# EAGLE board EEZ CF-DIC r3B2 (EAGLE 6.1)
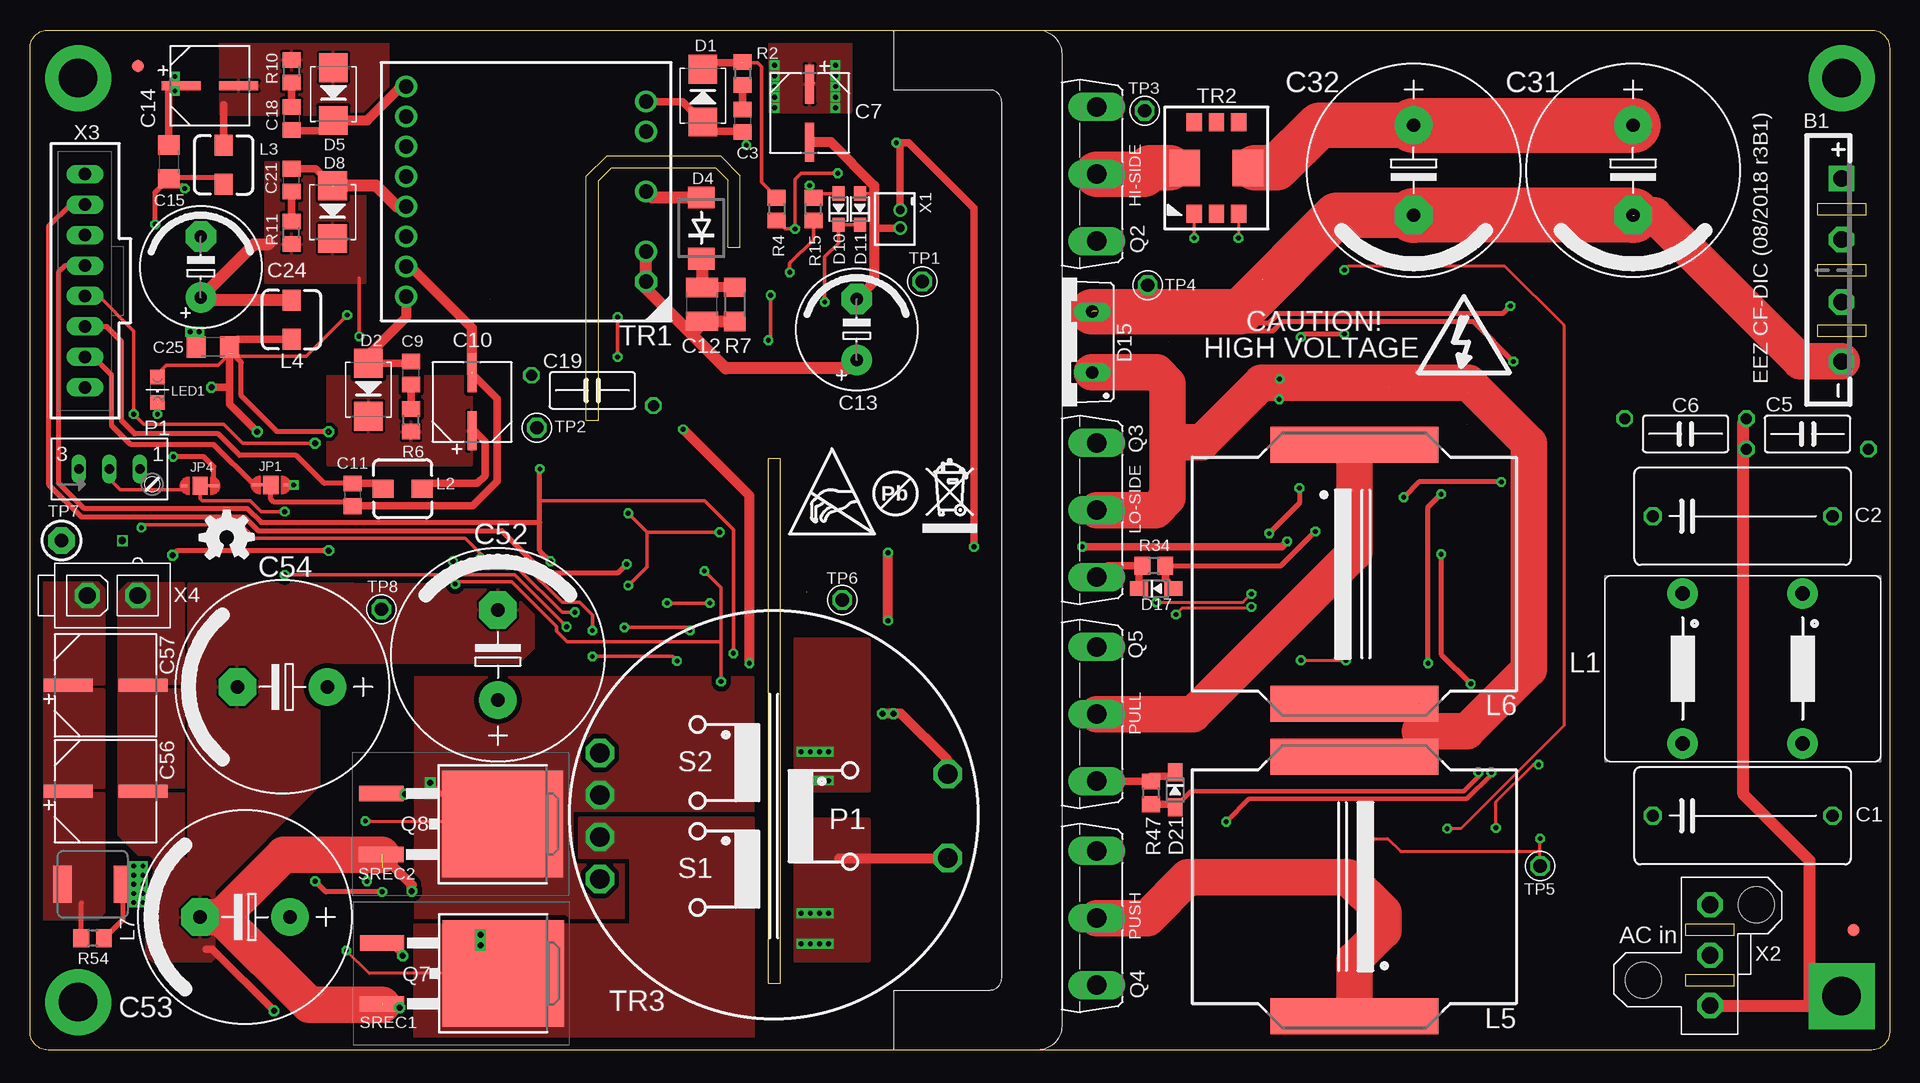
[diagram p3: board, top side]
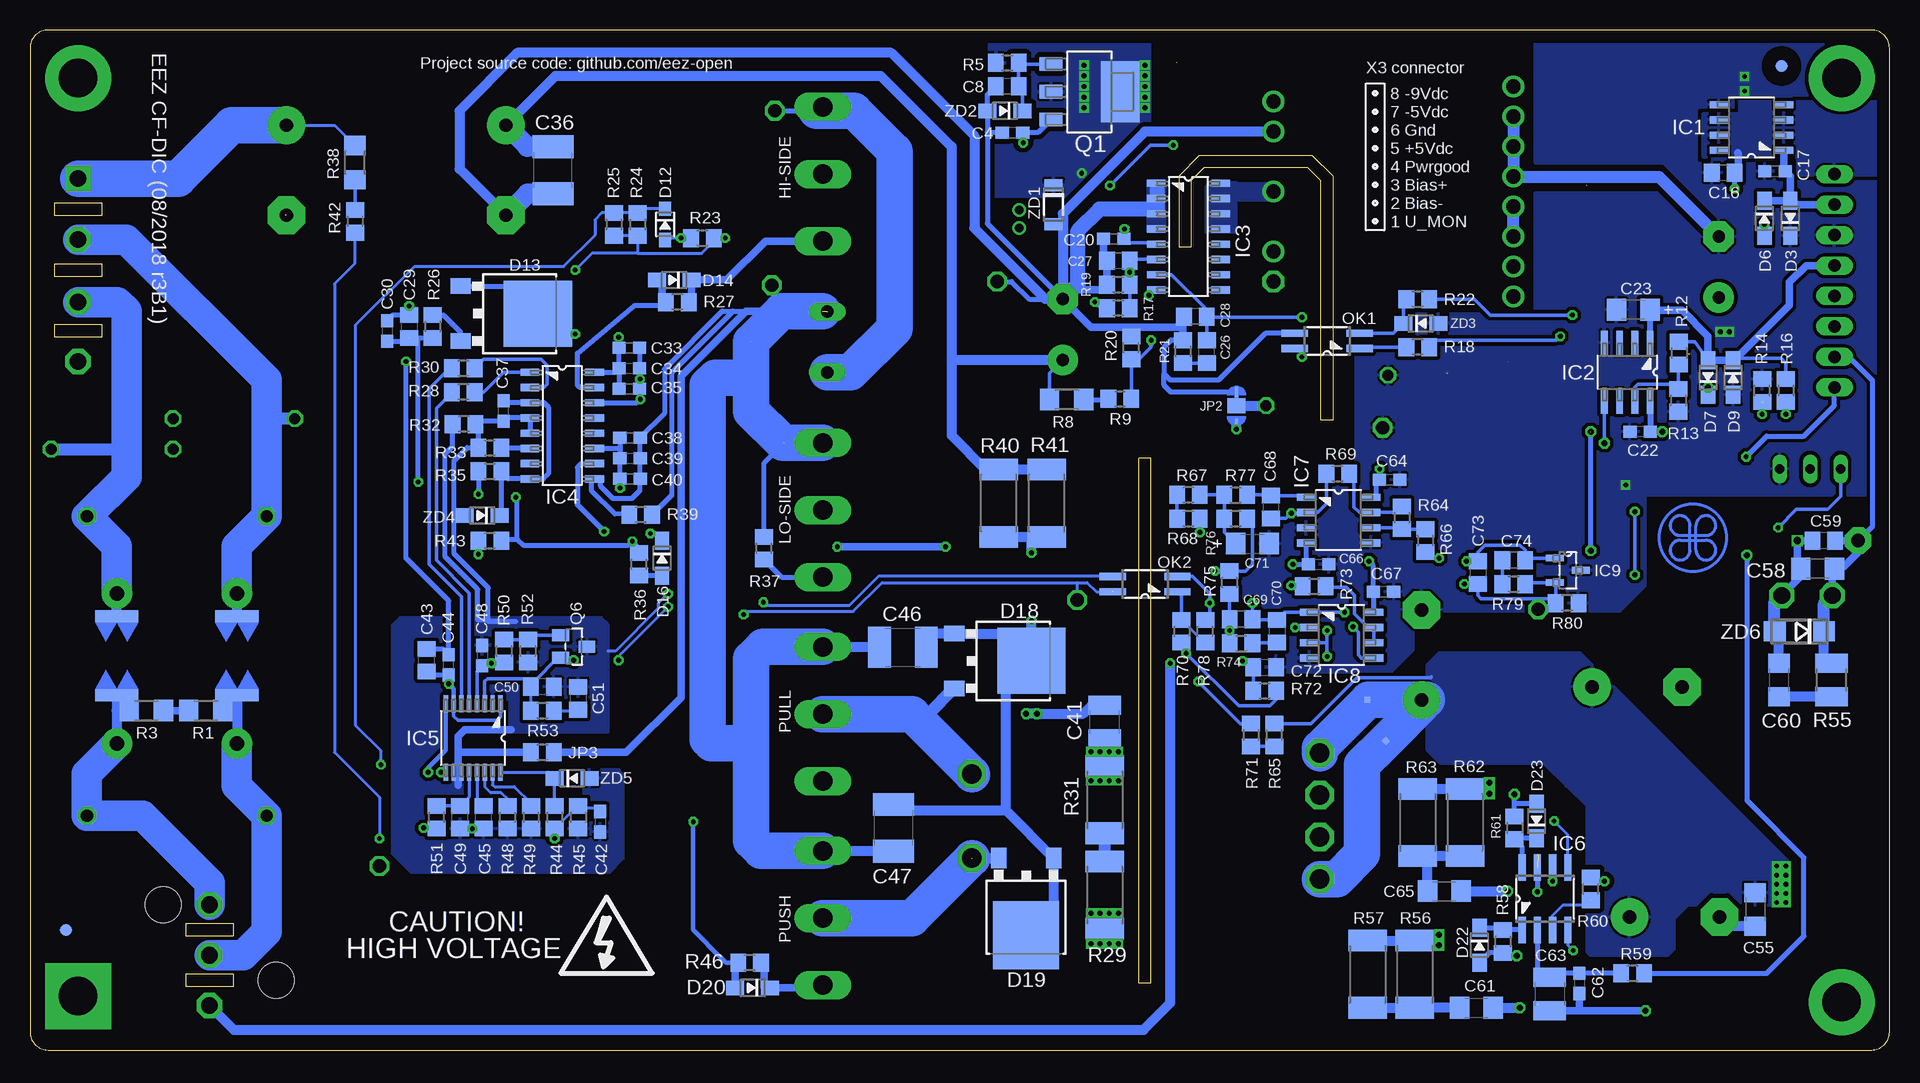
[diagram p4: board, bottom side, seen from below]

Size 155 x 85 mm. Coordinates in mm from the lower left corner, seen from the top.
Outline: 155,83.5 155,1.5 arc-90 153.5,0 1.5,0 arc-90 0,1.5 0,83.5 arc-90 1.5,85 153.5,85 arc-90 155,83.5
Outline: 59.2,66.9 59.2,72.87 57.55,74.52 48.09,74.52 46.37,72.8 46.37,52.48 47.39,52.48 47.39,72.42 48.47,73.5 57.17,73.5 58.18,72.49 58.18,66.9 59.2,66.9
Outline: 62.56,5.56 62.56,49.31 61.55,49.31 61.55,5.56 62.56,5.56
Copper layers (1*16): Top 0.035mm / dielectric 1.5mm / Bottom 0.035mm
Design rules: minimum track width 6mil, minimum drill 0.3mm, track to track 6mil, track to pad 6mil, pad to pad 6mil, via to via 6mil, smd to smd 6mil, copper to edge 40mil, drill to drill 8mil, minimum pad ring 4mil, minimum via ring 8mil, stop-mask expansion 2.5mil, vias tented up to drill 0.55mm, thermal gap 8mil
Net classes: 0 default: width 0.203 mm, drill 0.3 mm, clearance 0.203 mm; 1 lvds: width 0.152 mm, drill 0.3 mm, clearance 0.152 mm to class 0, clearance 0.152 mm; 2 gnd: width 0.254 mm, drill 0.584 mm, clearance 0.254 mm
tRestrict: area 81,0 to 86,85; area 69,0 to 81,5; area 69,80 to 81,85

## Footprints (pad centres in the part's own frame; a part is rotated, then mirrored left to right if it is on the bottom)
GBU4K_CRE = drill 1.4 square: + -7.62,0 | drill 1.4 octagon: - 7.62,0; AC1 -2.54,0; AC2 2.667,0
C150-084X183 = drill 1.016 octagon: 1 -7.493,0; 2 7.493,0
C0805 = smd 1.3 x 1.5: 1 -0.95,0; 2 0.95,0
C0603 = smd 1.1 x 1: 1 -0.85,0; 2 0.85,0
CY075-032X103 = drill 0.914 octagon: 1 -5.08,1.27; 2 5.08,-1.27
CAPAE660X610N = smd 3.251 x 0.762: 1 -2.413,0; 2 2.413,0
C1210 = smd 1.6 x 2.7: 1 -1.4,0; 2 1.4,0
ECAP5/10.5 = drill 1.016 pad 2.54: + -2.54,0 | drill 1.016 pad 2.54 octagon: - 2.54,0
C1206 = smd 1.6 x 1.8: 1 -1.4,0; 2 1.4,0
EC1206 = smd 1.6 x 1.8: + -1.4,0; - 1.4,0
ECAP7.5/18 = drill 1.1 pad 3.14: + -3.75,0 | drill 1.1 pad 3.14 octagon: - 3.75,0
C1812 = smd 1.9 x 3.4: 1 -1.95,0; 2 1.95,0
CAPAE830X1050N = smd 4.064 x 1.092: 1 -3.124,0; 2 3.124,0
SMB = smd 2.4 x 2.4: A 2.2,0; C -2.2,0
SOD323-W = smd 1.5 x 1.2: A 1.45,0; C -1.45,0
DO214AA = smd 1.8 x 2.2: A 2.55,0; C -2.55,0
SOD323-R = smd 1.2 x 1: A 1.3,0; C -1.3,0
TO252 = smd 1.3 x 1.7: 1 -2.285,-5.49; 2 2.285,-5.49 | smd 5.5 x 5.7: 3 0,0.95
TO220-2 = drill 1.016 long: 1 -2.54,-2.54; 2 2.54,-2.54
FIDUCIAL_DUAL = smd 1.016 x 1.016 bottom: B 0,0 | smd 1.016 x 1.016: T 0,0
SOIC127P600X173-8N = smd 1.55 x 0.6: 1 -2.7,1.9; 2 -2.7,0.63; 3 -2.7,-0.64; 4 -2.7,-1.91; 5 2.7,-1.91; 6 2.7,-0.64; 7 2.7,0.63; 8 2.7,1.9
SOIC127P600X175-8N = smd 1.981 x 0.559: 1 -2.464,1.905; 2 -2.464,0.635; 3 -2.464,-0.635; 4 -2.464,-1.905; 5 2.464,-1.905; 6 2.464,-0.635; 7 2.464,0.635; 8 2.464,1.905
SOIC-16 = smd 1.549 x 0.61: 1 -2.692,4.445; 2 -2.692,3.175; 3 -2.692,1.905; 4 -2.692,0.635; 5 -2.692,-0.635; 6 -2.692,-1.905; 7 -2.692,-3.175; 8 -2.692,-4.445; 9 2.692,-4.445; 10 2.692,-3.175; 11 2.692,-1.905; 12 2.692,-0.635; 13 2.692,0.635; 14 2.692,1.905; 15 2.692,3.175; 16 2.692,4.445
MTC16 = smd 1.422 x 0.356: 1 -2.845,2.275; 2 -2.845,1.625; 3 -2.845,0.975; 4 -2.845,0.325; 5 -2.845,-0.325; 6 -2.845,-0.975; 7 -2.845,-1.625; 8 -2.845,-2.275; 9 2.845,-2.275; 10 2.845,-1.625; 11 2.845,-0.975; 12 2.845,-0.325; 13 2.845,0.325; 14 2.845,0.975; 15 2.845,1.625; 16 2.845,2.275
SO8 = smd 0.6 x 2.2: 1 -1.905,-2.6; 2 -0.635,-2.6; 3 0.635,-2.6; 4 1.905,-2.6; 5 1.905,2.6; 6 0.635,2.6; 7 -0.635,2.6; 8 -1.905,2.6
SOT103P240X110-3N = smd 1.524 x 0.559: 1 -1.079,1.016; 2 -1.079,-1.016; 3 1.079,0
JP3-CUT = smd 1.27 x 1.524: COM 0,0 | smd 0.889 x 0.254: NC -1.143,0 | smd 0.508 x 0.254: NO 1.333,0
R0805 = smd 1.3 x 1.5: 1 -0.95,0; 2 0.95,0
RN214 = drill 1.2 pad 2.54: 1 -6.25,-5; 2 6.25,-5; 3 -6.25,5; 4 6.25,5
DE0403 = smd 1.5 x 1.75: 1 0,1.626; 2 0,-1.625
MURATA_6000B = smd 3 x 14: 1 -10.8,0; 2 10.8,0
IHLP-2020BZ-11 = smd 3.048 x 1.524: 1 0,2.515; 2 0,-2.515
LED_0805 = smd 1.2 x 1.2: A 0,-1.05; C 0,1.05
SO4 = smd 0.6 x 2.2: 1 -0.635,-2.7; 2 0.635,-2.7; 3 0.635,2.7; 4 -0.635,2.7
S64W = drill 0.813 long: A 2.54,1.27; E -2.54,1.27; S 0,1.27
SOT230P700X180-4N = smd 1.905 x 1.143: 1 -3.2,2.311; 2 -3.2,0; 3 -3.2,-2.311 | smd 3.175 x 5.08: 4 2.565,0
TO247BV = drill 1.6 long: D 0,-2.921; G -5.588,-2.921; S 5.588,-2.921
SOT23-BEC = smd 1 x 1.4: B -0.95,-1.1; C 0,1.1; E 0.95,-1.1
TO263 = smd 1.3 x 3.7: 1 -2.54,-7.87; 2 2.54,-7.87 | smd 8.9 x 10.1: 3 0,2.23
R1206 = smd 1.6 x 1.803: 1 -1.422,0; 2 1.422,0
R2512 = smd 1.8 x 3.2: 1 -2.8,0; 2 2.8,0
R1210 = smd 1.6 x 2.7: 1 -1.4,0; 2 1.4,0
PCB-SAR_2.4MM = smd 3.6 x 1: 1 0,-3.3; 2 0,3.3
SHORT_NOHOLE = smd 0.5 x 0.25 bottom: P$1 0,0.117; P$2 0,-0.117
PCB_SHIELD_TAB = drill 1.1 octagon: 1 0,0
TP_1.1MM_2 = drill 0.6 square: GND 5.08,0 | drill 1.1 pad 2.184 octagon: TIP 0,0
FERYSTER_5572 = drill 1.2 octagon: 1 -10,7.5 | drill 1.2: 2 -10,5; 4 -10,0; 6 -10,-5; 7 -10,-7.5; 8 10,-8.75; 9 10,-6.25; 10 10,-3.75; 11 10,-1.25; 12 10,1.25; 13 10,3.75; 14 10,6.25; 15 10,8.75
MURATA_5300 = smd 1.27 x 1.524: 1 -1.854,-3.81; 2 0,-3.81; 3 1.854,-3.81; 4 1.854,3.81; 5 0,3.81; 6 -1.854,3.81 | smd 2.54 x 3.048: 7 2.616,0; 8 -2.616,0
VAC_DUAL_SEC = drill 1.6 octagon: P1 -14.5,3.5; P1_DOT -14.5,-3.5; S1 14.5,5.25; S1_DOT 14.5,1.75; S2 14.5,-1.75; S2_DOT 14.5,-5.25
B2B-ZR = drill 0.7 pad 1.1: 1 -0.75,0; 2 0.75,0
MINIFIT_39301039_CRE = drill 1.4 octagon: 1 0,4.2; 2 0,0; 3 0,-4.2 | hole 3: 5.55,2.1; -3.85,-4.2
70543-08 = drill 1.016 long: 1 -8.89,0; 2 -6.35,0; 3 -3.81,0; 4 -1.27,0; 5 1.27,0; 6 3.81,0; 7 6.35,0; 8 8.89,0
MINIFIT_5566-02A = drill 1.4 octagon: 1 0,2.1; 2 0,-2.1
SOD123FL = smd 1 x 1.5: A 1.625,0; C -1.625,0
DO214AC = smd 1.8 x 1.7: A 2.05,0; C -2.05,0

## Placement (x,y rotation side)
B1  GBU4K  [GBU4K_CRE]  151,65 270 top
C1  MKP-X2-220NR15/310  [C150-084X183]  142.76,19.53 0 top
C2  MKP-X2-220NR15/310  [C150-084X183]  142.76,44.48 0 top
C3  3n3  [C0805]  59.39,77.44 270 top
C4  N.C.  [C0603]  73.11,76.42 180 bottom
C5  CY1Y-470P  [CY075-032X103]  148.16,51.34 0 top
C6  CY1Y-470P  [CY075-032X103]  138,51.34 180 top
C7  EEEFK1V470P  [CAPAE660X610N]  64.98,78.07 270 top
C8  470n  [C0805]  73.55,80.3 180 bottom
C9  3n3  [C0805]  31.77,56.42 90 top
C10  EEEFK1V470P  [CAPAE660X610N]  36.85,54.01 90 top
C11  1u  [C0805]  26.88,46.26 270 top
C12  1n/1kV  [C1210]  56.02,62.14 90 top
C13  UCY2G6R8MPD  [ECAP5/10.5]  68.91,60.04 90 top
C14  EEEFK1V470P  [CAPAE660X610N]  15,80.36 0 top
C15  4u7  [C1206]  11.57,74.01 270 top
C16  470n  [C0805]  13.86,73.12 0 bottom
C17  100n  [C0603]  9.54,73.25 0 bottom
C18  3n3  [C0805]  21.8,77.63 270 top
C19  CY1Y-470P  [CY075-032X103]  46.88,54.96 180 top
C20  100n  [C0603]  64.66,67.6 0 bottom
C21  3n3  [C0805]  21.8,72.49 90 top
C22  100n  [C0603]  20.78,51.53 180 bottom
C23  4u7  [EC1206]  21.35,61.69 180 bottom
C24  470u  [ECAP5/10.5]  14.24,65.25 90 top
C25  4u7  [C1206]  15.26,58.58 180 top
C26  33n  [C0805]  56.91,58.2 90 bottom
C27  100p  [C0805]  64.28,65.75 180 bottom
C28  2n2  [C0805]  57.87,61.12 180 bottom
C29  1u  [C0805]  123.4,60.29 270 bottom
C30  100n  [C0603]  125.24,59.91 270 bottom
C31  UCY2G121MHD  [ECAP7.5/18]  133.62,73.31 270 top
C32  UCY2G121MHD  [ECAP7.5/18]  115.33,73.31 270 top
C33  10n  [C0603]  105.05,58.52 0 bottom
C34  100n  [C0603]  105.05,56.8 0 bottom
C35  100n  [C0603]  105.05,55.09 0 bottom
C36  100n/500V  [C1812]  111.4,73.31 90 bottom
C37  100n  [C0603]  115.52,53.24 90 bottom
C38  10n  [C0603]  104.98,51.02 0 bottom
C39  100n  [C0603]  104.98,49.31 0 bottom
C40  100n  [C0603]  104.98,47.59 0 bottom
C41  2n2/1kV  [C1210]  65.42,27.34 90 bottom
C42  10n  [C0603]  107.46,19.02 270 bottom
C43  1u  [C0805]  121.94,32.48 90 bottom
C44  100n  [C0603]  120.09,32.1 90 bottom
C45  1u  [C0805]  117.17,19.4 90 bottom
C46  100n/500V  [C1812]  82.25,33.56 0 bottom
C47  100n/500V  [C1812]  83.01,18.51 90 bottom
C48  100n  [C0603]  117.3,32.86 270 bottom
C49  220p  [C0805]  119.14,19.4 90 bottom
C50  470p  [C0805]  112.28,30.26 180 bottom
C51  N.C.  [C0805]  109.3,29.31 270 bottom
C52  UPW1J152MHD  [ECAP7.5/18]  39.01,32.92 90 top
C53  UPW1J152MHD  [ECAP7.5/18]  17.92,11.08 180 top
C54  UPW1J152MHD  [ECAP7.5/18]  21.04,30.26 180 top
C55  1u/100V  [C1206]  11.19,11.72 270 bottom
C56  HHXC630ARA330MHA0G  [CAPAE830X1050N]  6.3,21.56 0 top
C57  HHXC630ARA330MHA0G  [CAPAE830X1050N]  6.3,30.38 0 top
C58  1u/100V  [C1206]  5.99,40.1 180 bottom
C59  100n/100V  [C0805]  5.48,42.45 180 bottom
C60  N.C.  [C1206]  9.22,30.83 270 bottom
C61  4n7/200V  [C1206]  34.43,3.52 0 bottom
C62  100n  [C0603]  25.86,5.56 270 bottom
C63  10u  [C1210]  28.34,4.67 270 bottom
C64  100n  [C0603]  41.67,47.53 0 bottom
C65  4n7/200V  [C1206]  37.1,13.24 0 bottom
C66  100n  [C0603]  47.58,40.48 0 bottom
C67  100n  [C0603]  42.18,38.2 0 bottom
C68  100p  [C0805]  51.58,45.24 270 bottom
C69  100p  [C0805]  54.05,35.91 180 bottom
C70  33n  [C0805]  51.07,34.89 270 bottom
C71  4u7  [EC1206]  53.1,42.2 0 bottom
C72  1u  [C0805]  52.09,31.91 0 bottom
C73  N.C.  [C0805]  34.31,39.78 270 bottom
C74  N.C.  [C0805]  31.32,40.8 180 bottom
D1  SS110B  [SMB]  56.09,79.53 270 top
D2  SS110B  [SMB]  28.21,55.02 90 top
D3  1N5819HW-7-F  [SOD323-W]  8.27,69.31 90 bottom
D4  US1K-DIO  [DO214AA]  55.96,68.48 90 top
D5  SS110B  [SMB]  25.29,79.66 90 top
D6  1N5819HW-7-F  [SOD323-W]  10.43,69.31 270 bottom
D7  1N5819HW-7-F  [SOD323-W]  15.13,56.04 90 bottom
D8  SS110B  [SMB]  25.23,69.82 90 top
D9  1N5819HW-7-F  [SOD323-W]  13.03,56.04 270 bottom
D10  BAS316  [SOD323-R]  67.39,70.07 90 top
D11  BAS316  [SOD323-R]  69.17,70.07 90 top
D12  BAS316  [SOD323-R]  102.06,68.8 270 bottom
D13  C3D02065E  [TO252]  113.62,61.37 270 bottom
D14  N.C.  [SOD323-W]  101.3,64.17 180 bottom
D15  C3D03060A  [TO220-2]  86,59 90 top
D16  1N5819HW-7-F  [SOD323-W]  102.31,40.99 270 bottom
D17  N.C.  [SOD323-W]  93.87,38.45 0 top
D18  C3D02065E  [TO252]  72.47,32.42 270 bottom
D19  C3D02065E  [TO252]  71.96,10.51 180 bottom
D20  1N5819HW-7-F  [SOD323-W]  94.76,5.18 180 bottom
D21  1N5819HW-7-F  [SOD323-W]  95.46,21.69 270 top
D22  1N5819HW-7-F  [SOD323-W]  34.18,8.73 270 bottom
D23  1N5819HW-7-F  [SOD323-W]  29.42,19.08 90 bottom
EEZ_SIGNATURE  SIGNATURESMALL  [SIGNATURE_5MM]  16.38,42.68 180 top
FM1  FIDUCIAL_2  [FIDUCIAL_DUAL]  9,82 0 top
FM2  FIDUCIAL_2  [FIDUCIAL_DUAL]  152,10 0 top
IC1  MC79L05  [SOIC127P600X173-8N]  11.51,76.87 180 bottom
IC2  LP2951  [SOIC127P600X175-8N]  21.86,56.48 270 bottom
IC3  VIPer35L  [SOIC-16]  58.44,67.79 0 bottom
IC4  SI8233BB-D-IS1  [SOIC-16]  110.63,52.04 0 bottom
IC5  LM5041B  [MTC16]  118.06,26 270 bottom
IC6  IR11688STRPBF  [SO8]  28.72,12.61 0 bottom
IC7  TL072  [SOIC127P600X173-8N]  45.93,44.16 0 bottom
IC8  TL103W  [SOIC127P600X173-8N]  45.67,34.58 0 bottom
IC9  TL431  [SOT103P240X110-3N]  26.81,39.97 0 bottom
JP1  JP3-CUT  [JP3-CUT]  20.08,47.09 0 top
JP2  JP3-CUT  [JP3-CUT]  54.44,53.69 270 bottom
JP3  0R  [R0805]  112.28,24.8 180 bottom
JP4  JP3-CUT  [JP3-CUT]  14.18,47.02 180 top
L1  RN214-2.5-02-3M3  [RN214]  142.76,31.78 270 top
L2  DLG-0403-180  [DE0403]  31.07,46.77 270 top
L3  DLG-0403-180  [DE0403]  16.15,73.76 0 top
L4  DLG-0403-180  [DE0403]  21.8,60.87 0 top
L5  60B684C  [MURATA_6000B]  110.38,13.62 90 top
L6  60B684C  [MURATA_6000B]  110.38,39.66 270 top
L7  IHLP2020CZER3R3M11  [IHLP-2020BZ-11]  5.22,13.81 270 top
LED1  LTST-C170YKT  [LED_0805]  10.62,55.02 180 top
OK1  TLP291-GB.SE-T  [SO4]  46.88,59.09 90 bottom
OK2  TLP291-GB.SE-T  [SO4]  62.06,38.83 90 bottom
P1  T910W-50K  [S64W]  6.62,47.15 0 top
Q1  BCP56-16.115  [SOT230P700X180-4N]  66.69,79.85 0 bottom
Q2  C3M0280090D  [TO247BV]  86,73 90 top
Q3  C3M0280090D  [TO247BV]  86,45 90 top
Q4  C3M0280090D  [TO247BV]  86,11 90 top
Q5  C3M0280090D  [TO247BV]  86,28 90 top
Q6  MMBT5401  [SOT23-BEC]  109.68,33.62 270 bottom
Q7  IRFS4321PBF  [TO263]  37.23,6.38 270 top
Q8  IRFS4321PBF  [TO263]  37.16,18.83 270 top
R1  220K  [R1206]  140.35,28.29 180 bottom
R2  120R  [R0805]  59.39,81.38 270 top
R3  220K  [R1206]  145.3,28.29 180 bottom
R4  22R  [R0805]  62.25,70.07 270 top
R5  1K8  [R0805]  73.55,82.26 0 bottom
R6  120R  [R0805]  31.77,52.48 90 top
R7  220K  [R1206]  58.75,62.14 90 top
R8  220K  [R1206]  68.6,54.2 0 bottom
R9  100K  [R0805]  64.15,54.26 0 bottom
R10  120R  [R0805]  21.8,81.57 270 top
R11  120R  [R0805]  21.8,68.1 90 top
R12  16K  [R0805]  17.54,58.07 270 bottom
R13  5K1  [R0805]  17.61,54.13 270 bottom
R14  470R  [R0805]  10.62,54.96 90 bottom
R15  N.C.  [R0805]  65.29,70.07 90 top
R16  10K  [R0805]  8.65,54.96 270 bottom
R17  47K  [R0805]  64.28,61.82 180 bottom
R18  750R  [R0805]  39.32,58.58 180 bottom
R19  12K  [R0805]  64.28,63.79 0 bottom
R20  1K8  [R0805]  63.2,58.52 90 bottom
R21  47K  [R0805]  58.88,58.2 90 bottom
R22  1K  [R0805]  39.32,62.58 0 bottom
R23  10K  [R0805]  98.95,67.66 0 bottom
R24  6R2  [R0805]  104.35,68.8 270 bottom
R25  N.C.  [R0805]  106.32,68.8 270 bottom
R26  10R  [R0805]  121.43,60.29 270 bottom
R27  10R  [R0805]  101.05,62.33 180 bottom
R28  100R  [R0805]  118.89,54.83 180 bottom
R29  22R/2W  [R2512]  65.42,12.92 270 bottom
R30  100R  [R0805]  118.89,56.8 180 bottom
R31  22R/2W  [R2512]  65.42,20.86 270 bottom
R32  1R  [R0805]  118.83,52.17 180 bottom
R33  30K  [R0805]  116.67,50.2 0 bottom
R34  10R  [R0805]  93.68,40.35 180 top
R35  10R  [R0805]  116.67,48.23 0 bottom
R36  10R  [R0805]  104.22,40.48 90 bottom
R37  47K  [R0805]  93.81,41.81 90 bottom
R38  220K  [R1206]  127.91,73.95 270 bottom
R39  1R  [R0805]  104.09,44.61 180 bottom
R40  22R/2W  [R2512]  74.25,45.56 90 bottom
R41  22R/2W  [R2512]  70.25,45.56 90 bottom
R42  100K  [R0805]  127.91,69.06 270 bottom
R43  10R  [R0805]  116.67,42.45 0 bottom
R44  1K  [R0805]  111.27,19.4 270 bottom
R45  6K8  [R0805]  109.3,19.4 270 bottom
R46  22R  [R0805]  95.01,7.27 180 bottom
R47  22R  [R0805]  93.42,21.43 270 top
R48  30K  [R0805]  115.21,19.4 270 bottom
R49  82K  [R0805]  113.24,19.4 270 bottom
R50  6K8  [R0805]  115.46,33.24 90 bottom
R51  1K  [R0805]  121.11,19.4 90 bottom
R52  6K8  [R0805]  113.49,33.24 270 bottom
R53  N.C.  [R0805]  112.28,28.29 0 bottom
R54  100R  [R0805]  5.22,9.3 180 top
R55  N.C.  [R1210]  4.84,30.83 90 bottom
R56  22R/3W  [R2512]  39.58,6.32 270 bottom
R57  22R/3W  [R2512]  43.51,6.32 270 bottom
R58  3R3  [R0805]  32.21,9.05 90 bottom
R59  10R  [R0805]  21.42,6.38 180 bottom
R60  47K  [R0805]  24.91,13.43 90 bottom
R61  3R3  [R0805]  31.26,18.51 270 bottom
R62  22R/3W  [R2512]  35.39,18.95 270 bottom
R63  22R/3W  [R2512]  39.32,18.95 270 bottom
R64  10K  [R0805]  40.66,44.35 270 bottom
R65  316K  [R0805]  51.26,26.26 90 bottom
R66  10K  [R0805]  38.69,42.45 270 bottom
R67  750R  [R0805]  58.44,46.26 180 bottom
R68  0R  [R0805]  58.44,44.29 0 bottom
R69  750R  [R0805]  45.99,48.04 0 bottom
R70  470R  [R0805]  59.01,34.89 270 bottom
R71  12K  [R0805]  53.23,26.26 270 bottom
R72  3K3  [R0805]  52.09,29.94 0 bottom
R73  750R  [R0805]  47.96,38.64 0 bottom
R74  30K  [R0805]  54.05,33.88 0 bottom
R75  10K  [R0805]  55.01,38.96 90 bottom
R76  16K  [R0805]  54.5,44.29 0 bottom
R77  220R  [R0805]  54.5,46.26 0 bottom
R78  N.C.  [R0805]  57.04,34.89 90 bottom
R79  N.C.  [R0805]  31.32,38.83 0 bottom
R80  N.C.  [R0805]  26.88,37.24 180 bottom
SAR1  PCB 2.4mm  [PCB-SAR_2.4MM]  137.75,32.86 0 bottom
SAR2  PCB 2.4mm  [PCB-SAR_2.4MM]  147.78,32.86 0 bottom
SH1  [SHORT_NOHOLE]  133.62,69.56 270 bottom
SH2  [SHORT_NOHOLE]  41.99,25.75 225 top
SH3  [SHORT_NOHOLE]  43.51,29.18 90 top
TP1  [PCB_SHIELD_TAB]  74.38,64.04 0 top
TP2  [PCB_SHIELD_TAB]  42.24,51.85 0 top
TP3  [PCB_SHIELD_TAB]  92.92,78.26 0 top
TP4  [PCB_SHIELD_TAB]  93.17,63.72 0 top
TP5  [PCB_SHIELD_TAB]  125.87,15.34 180 top
TP6  [PCB_SHIELD_TAB]  67.71,37.5 0 top
TP7  [TP_1.1MM_2]  2.62,42.45 0 top
TP8  [PCB_SHIELD_TAB]  29.29,36.73 0 top
TR1  Feryster 5572  [FERYSTER_5572]  41.35,71.53 180 top
TR2  53100C  [MURATA_5300]  98.89,73.5 0 top
TR3  VAC T60006-L2025-W380  [VAC_DUAL_SEC]  62,19.5 180 top
U$2  [RECYCLE_BIN1/8]  74.38,43.09 0 top
U$4  [ESD_SYMBOL]  63.3,43 0 top
U$5  [PB_SMALL]  72.15,46.39 180 top
X1  B2B-ZR  [B2B-ZR]  72.53,69.25 270 top
X2  39-30-1039  [MINIFIT_39301039_CRE]  140.03,7.91 180 top
X3  90136-1208  [70543-08]  4.59,64.1 90 top
X4  39-28-1023  [MINIFIT_5566-02A]  6.87,37.88 90 top
ZD1  BZT52C20-DC  [SOD123FL]  69.68,70.45 270 bottom
ZD2  BZX384-C13  [SOD323-W]  73.74,78.26 180 bottom
ZD3  MMSZ5V1T1G  [SOD323-W]  39.07,60.55 0 bottom
ZD4  MMSZ5V1T1G  [SOD323-W]  117.3,44.55 180 bottom
ZD5  PDZ6.2B  [SOD323-W]  109.81,22.64 0 bottom
ZD6  SMAJ58A-TR  [DO214AC]  7.51,34.89 180 bottom

## Tracks (layer width: path | path; a pad name or v marks a point on that pad's centre or on a via)
0V  (via drill 0.4)  (5 unrouted)
  Top 0.305: D11.A 70.09,71.37 70.37,71.09
  Top 0.406: D15.2 90.17,59.91 103.58,59.91 104.35,60.67 120.35,60.67 v123.65,57.37 | 88.53,61.5 89.49,60.55 103.27,60.55 104.09,61.37 122.76,61.37 v123.4,62.01 | C7.2 65.17,75.66
  Top 0.61: X1.2 70.39,68.5 70.37,68.48
  Top 0.813: 65.17,75.66 66.75,75.66 70.37,72.04 70.37,71.09 70.37,68.48 70.37,64.04 C13.-
  Top 3.81: D15.2 100.89,61.54 108.92,69.56 C32.-
  Top 4.572: C31.- C32.-
  Bottom 0.305: R20.2 63.2,60.17 63.14,60.23
  Bottom 0.406: C40.2 C39.2 C38.2 102.12,53.03 102.12,56.74 97.3,61.56 96.41,61.56 | C43.2 120.58,33.43 C44.2 120.09,37.43 123.65,40.99 v123.65,57.37 | C30.1 124.76,61.24 C29.1 v123.4,62.01 | 104.03,47.74 C40.2 | C40.2 104.16,47.57 104.16,46.64 104.86,45.94 106.38,45.94 107.46,47.02 107.46,47.47 | 107.46,47.47 107.39,47.53 | 107.46,47.47 107.58,47.59 IC4.9 108.03,47.59 108.22,47.4 108.22,46.64 106.25,44.67 R39.2 | 96.41,61.56 101.49,56.48 101.49,46.26 R39.1 | 96.41,61.56 95.33,61.56 | 88.53,61.56 91.58,61.56 93.17,63.15 TP4.1 | R37.2 93.81,48.93 92.16,50.58 | 75.19,76.49 ZD2.A 75.19,79.61 C8.2 | 75.19,76.49 75.19,68.86 C13.- | C4.2 75.13,76.42 75.19,76.49 | ZD1.A 68.95,68.83 68.91,68.87 | 68.98,64.04 68.98,62.64 C13.- | R21.2 59.9,59.15 60.47,58.58 60.47,56.36 | 60.47,56.36 59.96,55.85 55.9,55.85 52.02,59.72 OK1.3 | JP2.NC 59.9,54.83 60.47,55.4 60.47,56.36 | TP1.1 73.17,64.04 71.71,62.58 C13.-
  Bottom 0.61: 68.34,63.15 C13.- | JP3.1 105.3,24.8 100.73,29.37 100.73,56.17 95.33,61.56 91.58,61.56 88.56,61.56 D15.2 | C13.- 68.15,63.34 65.36,63.34 65.23,63.47 R19.1 C27.2 65.51,66.03 C20.1 | C13.- 66.56,60.23 63.14,60.23 58.88,60.23 | 58.88,60.23 58.88,61.18 C28.2 | R21.2 58.88,60.23
  Bottom 0.813: Q4.S 83.04,16.59 C47.1 | Q5.S 84.23,33.59 C46.1 | C32.- 119.21,73.43 119.21,78.26 114.38,83.09 83.2,83.09 76.28,76.17 76.28,68.48 70.37,62.58 C13.- | 69.49,63.22 C13.- | TR1.6 62.07,76.53 68.91,69.69 68.91,68.87 C13.-
  Bottom 1.27: 61.04,71.66 61.04,70.07 65.87,70.07 67.64,68.29 67.64,63.85 C13.- | 98.63,26.32 98.5,26.45 | 98.31,25.3 97.87,25.3 | 97.87,25.3 97.74,25.3 97.49,25.56 98.76,26.83 | 98.31,24.86 97.87,25.3
  Bottom 1.676: C36.1 113.53,71.36 C32.-
  Bottom 3.048: Q5.S 93.91,33.59 94.89,32.61 94.89,25.81 | 94.89,25.81 94.89,17.43 94.04,16.59 Q4.S | 94.89,25.81 95.14,25.56 97.49,25.56 98.19,25.56 98.5,25.88 98.5,26.45 98.5,55.4 97.87,56.04 94.89,56.04 | 94.89,59.02 94.89,56.04 | 94.89,56.04 94.89,53.24 92.23,50.59 Q3.S | 94.88,59.03 92.33,61.57 88.92,61.57
  pour Bottom (no thermals): 61.87,72.42 61.87,68.23 60.41,68.23 60.41,72.42
6VAC  (1 unrouted)
  Top 0.61: D8.A 23.81,73.44 C21.2
  Top 1.016: TR1.12 30.6,70.28 28.85,72.04 25.29,72.04
  Bottom 1.016: TR1.13 TR1.12
7VAC
  Top 0.61: 25.16,77.33 D5.C 24.44,76.61 21.8,76.61 C18.2
  Top 0.813: D5.C 28.11,77.46 31.12,80.47 TR1.8
15VAC  (1 unrouted)
  Top 0.61: D2.A 31.77,57.22 C9.2
  Top 0.813: D2.A 28.21,57.94 31.39,61.12 31.39,62.75 TR1.15
+6V  (via drill 0.4, 0.5)  (3 unrouted)
  Top 0.305: 16.65,58.01 16.66,58.01 C25.1 17.42,57.82 23,57.82 v26.43,61.25 | 16.65,58.01 16.65,57.82 | 16.65,58.01 15.7,57.05 11.35,57.05 10.62,56.33 LED1.A
  Top 0.406: v24.91,51.53 20.59,51.53 17.61,54.52 17.61,57.31 16.91,58.01 | v24.91,41.62 12.27,41.62 v11.89,41.24
  Top 0.61: L4.2 17.32,59.24 C25.1 16.65,55.21 | v18.94,51.53 16.65,53.82 16.65,55.21 | v15.13,55.21 16.65,55.21
  Bottom 0.305: v26.43,61.25 33.29,61.25 34.62,62.58 R22.2
  Bottom 0.406: R59.1 10.24,6.38 7.13,9.49 7.13,16.03 11.35,20.26 11.83,20.73 11.89,20.8 v11.89,41.24 | v24.91,41.62 24.91,51.47
  Bottom 0.508: IC2.8 19.96,51.55 C22.1 v18.94,51.53
  Bottom 0.61: D7.C v15.13,55.21
+6V_REC  (via drill 0.4)
  Top 0.305: v27.45,59.47 27.45,64.29
  Top 1.016: L4.1 14.46,62.49 C24.+ 18.69,67.15 19.89,67.15 19.96,67.22
  Bottom 0.305: R18.1 38.37,59.15 27.77,59.15 v27.45,59.47
  pour Top (isolate 0.254): 19.64,73.95 19.64,63.98 27.96,63.98 27.96,73.95
+12V  (via drill 0.4)  (1 unrouted)
  Top 0.406: v122.64,47.34 115.78,47.34 v114.51,46.07
  Top 0.61: v87.71,41.94 104.35,41.94 v104.79,42.39 | v78.69,41.94 78.69,70.14 73.23,75.6 v72.22,75.6 72.53,75.28 X1.1
  Bottom 0.406: v122.64,47.34 122.64,59.34 C29.2 | C30.2 123.68,59.06 C29.2 R26.2 | 114.38,42.58 114.38,42.51 115.65,42.51 R43.2 | 114.38,42.58 114.38,45.94 v114.51,46.07 | 114.38,42.58 113.87,42.07 105.11,42.07 v104.79,42.39 104.22,41.81 R36.2 | v72.22,75.6 72.25,75.64 C4.1 72.03,76.42 71.96,76.49 70.95,76.49 Q1.3
  Bottom 0.61: v78.69,41.94 v87.71,41.94
+15V_REC
  Top 0.61: L2.1 32.69,47.19 32.72,47.21 37.29,47.21 37.93,47.85 37.93,50.7 37.04,51.59 C10.1
  pour Top (isolate 0.305): 36.78,48.74 24.84,48.74 24.84,56.17 36.78,56.17
-7V_REC
  Top 0.61: C14.2 17.71,80.42 | 17.22,80.36 C14.2 | 16.59,80.42 C14.2 | L3.1 16.14,78.77
  pour Top (isolate 0.254): 29.8,77.95 15.89,77.95 15.89,84.55 29.8,84.55
-9V  (via drill 0.4)
  Top 0.406: v10.43,68.8 10.43,71.47 C15.2 | C15.2 11.57,72.74 15.7,72.74 16.14,72.3 L3.2 | C15.2 11.57,72.04 12.65,72.04 v12.91,71.79
  Bottom 0.406: D6.A v10.43,68.8 | v12.91,71.79 C16.2
  Bottom 0.61: C16.2 12.59,73.12 12.59,74.71 12.65,74.77
  pour Bottom (isolate 0.254): 0.84,79.03 12.53,79.03 12.53,78.01 15.57,78.01 15.57,74.45 7.7,74.45 7.7,72.93 0.84,72.93
-15V  (1 unrouted)
  Top 0.406: JP1.COM 20.08,45.88 20.27,45.69 26.5,45.69 C11.2
  Top 0.61: 26.88,45.18 C11.2 26.88,45.37 36.91,45.37 38.94,47.4 38.94,54.26 36.85,56.36
  Top 0.813: C10.2 36.85,60.17 31.73,65.28 TR1.14
AGND  (via drill 0.4)  (2 unrouted)
  Top 0.254: TR2.1 97.03,67.67 v97.04,67.66 | v118.13,18.45 119.27,18.45 127.84,27.02 127.84,60.42 122.95,65.31 109.87,65.31 v109.55,64.99 | v93.87,37.31 101.11,37.31 v101.81,38.01
  Bottom 0.254: v97.04,67.66 R23.2 98,67.4 99.01,66.39 104.35,66.39 | 104.35,66.39 R24.2 R25.2 | v118.13,18.45 118.19,18.45 | v93.87,37.31 93.61,37.05 86.69,37.05 84.28,39.47 OK2.3 | 104.35,66.39 108.16,66.39 v109.55,64.99 | v101.81,38.01 101.87,38.01 102.63,37.24 102.63,36.8 106.19,33.24 106.82,33.24
  Bottom 0.406: IC4.5 IC4.4 115.25,52.67 C37.1 117.64,52.4 R32.1 117.62,51.91 R33.1 | 114.51,35.72 116.79,35.72 116.79,38.51 119.65,41.37 119.65,44.55 | 114.7,35.72 117.68,35.85 117.68,38.39 120.41,41.12 120.41,49.69 119.78,50.32 R32.2 | ZD4.A 119.65,44.55 | 119.65,44.55 119.65,49.12 118.57,50.2 R33.1
  Bottom 0.61: 119.33,24.8 119.33,26.13 118.76,26.7 114.89,26.7 | 119.33,24.8 119.33,24.79 | 119.33,24.79 119.33,22.07 | 119.33,24.79 118.51,24.79 JP3.2 | 119.33,24.79 119.33,24.8
  pour Bottom (isolate 0.305): 105.93,23.34 108.86,23.34 108.86,18.57 118.7,18.57 118.7,23.72 120.67,23.72 120.67,29.24 115.02,29.24 115.02,26.51 106.82,26.51 106.82,35.47 107.39,36.04 124.16,36.04 124.79,35.4 124.79,16.35 123.27,14.83 106.7,14.83 105.55,15.97 105.55,22.96
AUX  (via drill 0.4)
  Top 0.305: v59.71,75.41 59.71,76.36 | D10.A 65.64,71.37 R15.2 64.98,71.34 v64.98,72.04
  Top 0.61: D1.A 56.87,76.55 59.39,76.55 C3.2 59.39,76.36 59.71,76.36 | 56.06,77.31 D1.A | TR1.7 54.39,79.03 D1.A
  Bottom 0.305: v59.71,75.41 61.61,75.41 v64.98,72.04
AUX_OUT  (via drill 0.4)
  Top 0.305: 65.29,80.61 C7.1 | v67.33,73.06 64.28,73.06 63.77,72.55 v63.77,68.42 62.95,68.42 R4.2
  Bottom 0.305: IC3.5 61.23,67.15 61.29,67.22 61.29,67.28 63.49,67.28 C20.2 63.77,67.64 v63.77,68.42
  other vias: 67.14,80.3 67.14,79.41 67.14,78.52 67.14,81.19 67.14,82.07 62.06,80.3 62.06,81.19 62.06,82.07 62.06,79.41 62.06,78.52
  pour Bottom (isolate 0.406): 75.01,71.15 75.01,84.8 61.67,84.8 61.67,74.2 64.85,71.15
  pour Top (isolate 0.406): 68.41,78.2 68.41,84.8 61.67,84.8 61.67,78.2
BUCK_OUT  (via drill 0.4)
  Top 0.305: 102.63,55.59 103.08,55.59 v104.16,55.91 | 103.46,54.45 103.52,54.52
  Top 0.406: v104.13,54.24 103.43,54.43 103.46,54.45
  Top 2.54: L6.2 115.9,28.86 115.84,28.8 115.84,26.57 115.84,24.48 115.78,24.42 L5.2
  Top 3.048: 115.84,26.57 119.78,26.57 124.92,31.72 124.92,50.58 119.9,55.59 102.63,55.59 97.68,50.64 95.14,50.64 94.82,50.32 | Q3.D 93.82,45 94.82,46.01 94.82,50.32 | 94.82,50.32 94.82,55.53 93.89,56.46 D15.1
  Bottom 0.305: C34.2 104.19,55.95 v104.16,55.91 104.19,55.87 C35.2
  Bottom 0.406: IC4.14 104.41,53.94 104.16,54.2 v104.13,54.24 C35.2 | C33.2 104.19,57.22 104.16,57.18 104.16,56.84 C34.2 | TP3.1 89.42,78.26 89.25,78.26 Q2.S
  Bottom 0.508: C33.2 104.19,58.54
  Bottom 3.048: D15.1 86.59,56.46 82.95,60.1 82.95,74.9 86.31,78.26 89.42,78.26
CLAMP_C  (via drill 0.4)
  Top 0.813: v71.52,35.78 v71.52,41.43
  Bottom 0.813: D19.3 69.68,11.85 D19.1 73.65,19.97 | D18.3 73.81,34.7 D18.1 80.09,34.7 80.15,34.64 80.15,33.71 C46.2 | C47.2 83.01,20.04 83.08,19.97 73.65,19.97 | 73.65,19.97 73.65,29.91 73.61,29.94 73.61,30.32 D18.3 | D18.3 v71.52,35.78 | v71.52,41.43 71.52,42.77 | 71.52,42.77 R41.1 | R40.1 71.52,42.76 71.52,42.77
CT_OUT  (via drill 0.4)
  Top 0.254: v122.19,18.51 122.19,20.67 125.3,23.78 v125.75,23.78
  Bottom 0.254: 121.11,18.39 R51.1 121.17,18.51 v122.19,18.51 | D12.C 104,70.1 R24.1 R25.1 107.33,69.75 107.9,69.18 107.9,67.91 110.51,65.31 122.95,65.31 127.84,60.42 127.84,27.02 125.75,24.92 v125.75,23.78
DC_BUS
  Top 1.016: TR1.2 TR1.1 51.35,63.44 55.13,59.66 | C13.+ 68.22,56.8 57.99,56.8 55.13,59.66 | 55.13,59.66 56.02,60.55 C12.1 58.73,60.73 R7.1
  Top 2.54: TR2.7 102.12,73.5
  Top 3.81: 102.12,73.5 103.9,73.5 107.46,77.06 C32.+
  Top 4.572: C32.+ C31.+
  Bottom 0.254: C31.+ 129.6,77.06 R38.1
  Bottom 0.305: R8.1 70.02,56.4 C13.+
  Bottom 0.813: C32.+ 111.2,81.19 84.09,81.19 78.19,75.28 78.19,57.56 | 78.19,57.56 78.19,51.21 75.33,48.36 R40.2 R41.2 | C13.+ 78.12,57.5 78.19,57.56
  Bottom 1.676: C36.2 113.53,75.26 C32.+
  Bottom 3.048: B1.+ 142.63,72.62 138.19,77.06 C31.+
DC_OUT
  Top 0.406: C11.1 24.53,47.21 22.18,49.56 17.48,49.56 15.7,51.34 8.72,51.34 7.64,52.42 7.64,59.02 6.37,60.29 X3.3
  Top 0.61: C11.1 29,47.21 L2.2
FB  (via drill 0.4)
  Top 0.305: 57.61,34.01 44.78,34.01 43.9,34.89 43.9,35.27 40.15,39.02 35.64,39.02 v35.45,38.83 | 57.61,34.01 57.61,38.51 v56.21,39.91 | 57.61,34.01 v57.61,30.7
  Bottom 0.305: R75.2 | R76.2 53.1,44.67 53.1,40.48 53.68,39.91 R75.2 | R79.2 30.24,38.96 IC9.2 27.83,38.89 R80.2 28.21,37.62 29.29,37.62 | v35.45,38.83 C73.2 34.31,37.88 34.05,37.62 29.29,37.62 | v56.21,39.91 R75.2 | R71.1 54.12,27.21 v57.61,30.7 | TP8.1 29.29,37.62
FB2
  Bottom 0.305: ZD3.C 40.52,62.33 R22.1 | ZD3.C 40.52,60.24 40.59,60.17 | OK1.2 41.34,59.72 ZD3.C
GND  (via drill 0.4, 0.5)  (2 unrouted)
  Top 0.254: v28.08,14.07 28.08,16.16 27.96,16.29
  Top 0.305: JP1.NO v21.99,47.09
  Top 0.406: v14.11,59.85 14.24,58.96 C25.2 | Q7.2 29.35,3.52 v30.81,3.52 | v29.35,13.18 24.65,13.18 v23.77,14.07
  Top 0.508: v12.08,79.92 12.08,80.17 C14.1
  Top 0.61: v20.34,3.27 15.19,8.41 14.68,8.41 | C15.1 11.57,80.17 | 11.57,80.17 11.57,80.3 | 12.08,80.17 11.57,80.17
  Top 0.813: v31.83,13.24 31.83,13.75 Q8.2
  Top 3.048: 29.35,3.78 23.26,3.78 15.95,11.08 | Q8.2 27.96,16.29 21.16,16.29 15.95,11.08 | 15.95,11.08 C53.-
  Bottom 0.254: v23.77,14.07 24.59,14.07 R60.2
  Bottom 0.406: IC6.7 v29.35,13.18 | IC6.6 v28.08,14.07
  Bottom 0.61: v20.34,3.27 22.82,3.27 25.86,3.27 | 25.86,3.27 C63.2 | C62.2 25.86,3.27 | C59.2 TP7.GND 7.7,40.6 C58.2 7.39,39.47 X4.2
  Bottom 0.813: C65.2 v31.83,13.24 | C61.2 v30.81,3.52 | C55.2 13.41,10.32 C53.- | C60.1 9.22,34.56 ZD6.A
  Bottom 1.016: TR1.9 TR1.10 TR1.11 31.31,72.74 19.19,72.74 C24.- | ZD6.A 9.61,34.94 9.61,37.24 X4.2
  other vias: 12.08,81.12 13.35,59.85
  pour Top (isolate 0.406): 13.29,15.97 13.29,38.89 40.66,38.83 41.93,37.56 41.93,33.5 40.72,32.29 24.72,32.29 24.08,31.66 24.08,22 15.32,13.24 15.32,7.65 15.07,7.4 10.24,7.4 9.73,7.91 9.73,15.91
  pour Bottom (isolate 0.305, rank 3): 0.08,85.12 29.54,85.12 29.54,73.95 18.88,73.95 14.3,69.37 14.3,67.6 15.51,67.6 19.32,71.41 29.54,71.41 29.54,61.31 44.53,61.31 44.53,48.16 60.53,48.16 60.53,31.53 41.48,31.53 39.7,33.31 39.7,36.61 22.43,36.61 20.34,38.7 20.34,46.26 0.08,46.26
  pour Top (isolate 0.406, no thermals): 8.21,38.89 12.78,38.89 12.78,30.51 11,30.51 11,30 12.78,30 12.78,21.88 11,21.88 11,21.37 12.78,21.37 12.78,15.53 9.73,15.59 7.45,17.88 7.45,38.13
GNDA
  Top 3.048: B1.- 147.58,57.38 135.4,69.56 SH1.P$1
HD  (1 unrouted)
  Bottom 0.305: IC5.5 118.39,38.08 121.11,40.8 121.11,53.5 119.84,54.77 | R28.2 119.84,54.77
HI_OUT  (1 unrouted)
  Bottom 0.406: 102.31,62.33 R27.2 102.31,62.01 104.67,62.01 109.36,58.07 109.36,55.4 109.17,55.21 IC4.15 | 102.31,64.17 D14.A
  Bottom 0.61: 102.31,62.33 102.31,64.17
HOLE_DL  (via drill 3.2 pad 5.5)
  other vias: 4,4
HOLE_UL  (via drill 3.2 pad 5.5)
  other vias: 4,81
HOLE_UR  (via drill 3.2 pad 5.5)
  other vias: 151,81
ISO_FB  (via drill 0.4)  (1 unrouted)
  Top 0.254: 95.78,36.54 v95.52,36.29 96.03,36.8 101.68,36.8 v101.81,36.92 | v105.93,32.48 v109.68,32.48
  Bottom 0.254: R53.1 C50.2 | v95.52,36.29 95.27,36.54 86.38,36.54 83.96,38.96 67.71,38.96 | Q6.E 109.87,32.67 v109.68,32.48 | v105.93,32.48 105.93,32.8 v101.81,36.92 | 67.71,38.96 66.88,38.96 66.12,38.2 64.72,38.2 | TP6.1 67.71,38.96
  Bottom 0.305: IC5.3 117.09,30.73 116.86,30.96 113.3,30.96 | 113.3,30.96 112.73,30.96 111.22,32.46 Q6.E | C50.2 113.23,30.89 113.3,30.96
L_PULL  (via drill 0.5)
  Top 0.813: v71.07,28.04 v71.96,28.04 72.6,28.04 76.5,24.13 TR3.P1_DOT
  Top 3.048: L6.1 110.38,41.43 96.94,28 Q5.D
  Bottom 0.813: 86.66,28.04 86.69,28 | C41.2 66.5,28.74 67.2,28.04 v71.07,28.04 v71.96,28.04
  Bottom 1.016: 86.66,28.04 80.06,28.04 D18.2
  Bottom 3.048: Q5.D 86.69,28 81.5,28 TR3.P1_DOT
L_PUSH  (via drill 0.4)  (1 unrouted)
  Top 0.813: 67.45,15.97 76.53,15.97
  Top 3.048: Q4.D 93.15,11 96.54,14.38 109.87,14.38 112.79,11.46 112.79,9.94 110.38,7.53 L5.1
  Bottom 0.813: TR3.P1 73.99,16 D19.2 | R29.2 v65.04,8.86
  Bottom 3.048: Q4.D 81.5,11 TR3.P1
  other vias: 66.56,11.4 65.04,11.4 64.28,11.4 65.8,11.4 66.56,8.86 64.28,8.86 65.8,8.86
  pour Top (isolate 0.305): 69.93,7.4 63.33,7.4 63.33,19.27 69.93,19.27
LD
  Bottom 0.305: IC5.6 119.04,37.77 121.75,40.48 121.75,55.09 120.03,56.8 R30.2
LO_OUT  (via drill 0.4)
  Top 0.406: R34.1 94.63,40.73 | R34.1 94.63,40.48 | R34.1 104.28,40.35 v107.14,43.21
  Top 0.61: R34.1 94.63,39.27 D17.A
  Bottom 0.406: IC4.10 109.05,48.86 109.36,48.55 109.36,45.43 v107.14,43.21
N$1  (via drill 0.4)
  Top 0.305: v57.48,43.15 51.45,43.15 | 51.45,43.15 v49.86,44.74 | 51.45,43.15 51.45,40.29 v49.86,38.7
  Bottom 0.305: R69.1 46.94,45.5 47.65,44.79 IC7.2 48.69,44.74 v49.86,44.74 50.31,44.29 C68.2 | R68.2 v57.49,43.15 v57.48,43.15 | R73.1 48.97,38.7 v49.86,38.7
N$2
  Bottom 0.305: R38.2 R42.1
N$3  (via drill 0.4)
  Top 0.406: v109.55,59.66 106.19,59.66 v105.93,59.4
  Bottom 0.305: 106.21,56.48 C34.1
  Bottom 0.406: C35.1 C34.1 C33.1 105.89,59.37 v105.93,59.4 | IC4.16 106.21,56.48 | D13.1 114.95,63.66 D13.3 111.65,59.66 v109.55,59.66
N$4
  Bottom 0.813: JP2.COM C19.1
N$5  (via drill 0.4)
  Bottom 0.813: R31.1 v65.8,22.45
  Bottom 1.016: C41.1 R31.1
  other vias: 66.56,22.45 65.04,22.45 64.28,22.45 64.28,24.86 66.56,24.86 65.04,24.86 65.8,24.86
  pour Top (isolate 0.305): 69.93,21.56 63.33,21.56 63.33,34.26 69.93,34.26
N$6
  Bottom 0.406: IC6.2 29.35,6.13 29.29,6.07 C63.1 28,6.41 C62.1 25.84,6.38 R59.2
N$7  (via drill 0.4)  (1 unrouted)
  Top 0.305: v46.88,34.96 46.88,36.23 45.8,37.31 44.34,37.31 40.91,40.74 37.8,40.74 v37.55,40.99 37.55,41.37 36.27,42.64 18.75,42.64 17.61,43.78 9.54,43.78 v9.29,43.53 | v46.88,32.8 53.55,32.8 v53.93,32.42
  Bottom 0.305: R72.1 C72.1 53.54,32.42 v53.93,32.42 | 48.34,33.94 46.88,33.94 | 46.88,33.94 v46.88,34.96 | v46.88,32.8 46.88,33.94 | R66.2 38.69,41.05 37.61,41.05 v37.55,40.99 | P1.E 4.08,46.13 5.16,45.05 7.76,45.05 v9.29,43.53
N$8
  Bottom 0.813: R55.1 C60.2
N$9
  Bottom 0.305: C70.2 53.04,33.94 R74.2
N$10  (via drill 0.4)
  Top 0.305: v49.55,35.21 54.75,35.21 v55.01,34.96
  Bottom 0.305: R75.1 C69.2 v55.01,34.96 v55.01,34.95 R74.1 | IC8.2 v49.54,35.21 v49.55,35.21
N$12
  Bottom 0.305: R71.2 R65.1
N$13
  Bottom 0.61: R46.1 93.81,7.01 93.81,5.24 93.74,5.18 D20.C 89.16,5.18 Q4.G
N$14
  Top 0.406: 93.39,22.41 R47.1
  Top 0.61: Q5.G 93.39,22.41 | R47.1 93.42,22.83 95.15,22.83 D21.C
N$15
  Bottom 0.813: SAR1.2 137.75,38.02 L1.1
  Bottom 1.016: C6.2 135.27,52.61
  Bottom 2.54: L1.1 137.76,41.99 C2.1 135.27,52.61 135.27,55.85 146.96,67.54 B1.AC1
N$17
  Bottom 0.305: R79.1 C74.2
N$18  (1 unrouted)
  Bottom 0.254: IC6.3 28.08,11.21 27.19,12.1 25.29,12.1 R60.1
N$19
  Bottom 0.254: IC5.15 116.44,22.09 116.28,21.94 114.63,21.94 113.24,20.54 R49.1
N$20  (via drill 0.4)
  Top 0.305: v61.74,62.9 61.74,59.34 v61.55,59.15
  Bottom 0.305: IC3.8 61.29,63.34 v61.74,62.9 | 62.88,57.24 R20.1 | R20.1 62.56,57.57 61.55,58.58 v61.55,59.15 | R9.2 R20.1
  Bottom 0.406: 62.88,57.24 R20.1
N$21
  Bottom 0.61: R27.1 99.85,62.57 D14.C 96.93,64.17 93.68,67.41 Q2.G
N$22
  Bottom 0.254: R48.1 115.21,20.92 115.71,21.43 116.6,21.43 117.09,21.92 IC5.14
N$23
  Bottom 0.254: IC5.13 117.74,20.91 C45.2
N$24
  Bottom 0.813: SAR2.2 147.78,38.02 L1.3
  Bottom 1.016: C5.2 147.02,50.07 146.96,50.01
  Bottom 2.54: L1.3 147.76,41.99 C2.2 146.96,47.78 146.96,50.01 146.96,61.56 147.72,62.33 B1.AC2
N$25
  Bottom 0.254: IC5.16 111.78,23.16 ZD5.C 111.27,22.63 R44.1
N$27  (1 unrouted)
  Top 0.305: 59.39,82.26 60.66,82.26 60.98,81.95 60.98,72.29 R4.1
  Top 0.61: 56.19,81.73 D1.C 56.62,82.26 59.39,82.26
N$28
  Bottom 0.813: SAR1.1 137.75,28.29 | 137.75,28.29 137.75,25.55 L1.2 | R1.1 137.75,28.29
  Bottom 2.54: X2.2 137.24,7.91 135.27,9.87 C1.1 137.76,22.02 L1.2
N$29
  Top 0.406: 92.42,40.17 R34.2
  Top 0.61: D17.C 92.42,40.17 | R34.2 89.86,40.35 Q3.G
  Bottom 0.406: R37.1 92.35,39.41 Q3.G
N$30
  Bottom 0.61: 147.25,26.05 L1.4
  Bottom 0.813: SAR2.1 147.78,28.29 | 147.78,28.29 147.78,26.57 147.25,26.05 | R3.2 147.53,28.29 | 147.53,28.29 147.59,28.23 | 147.53,28.29 147.78,28.29
  Bottom 2.54: X2.3 140.03,13.94 145.62,19.53 C1.2 150.26,23.04 L1.4
N$31
  Bottom 0.406: R26.1 120.54,61.24 119.11,59.81 D13.2
N$33
  Bottom 0.61: R3.1 R1.2
N$35
  Bottom 0.254: R53.2 109.3,28.29 C51.2
N$36
  Bottom 0.305: IC4.1 115.52,56.48 117.17,54.83 R28.1
N$37
  Bottom 0.254: IC5.12 118.39,21.1 C49.2
  Bottom 0.305: R51.2 C49.2
N$40  (1 unrouted)
  Bottom 0.305: 113.3,55.21 112.16,55.21 111.9,55.47 111.9,57.05 112.41,57.56 117.18,57.56 R30.1
N$41
  Bottom 1.016: R31.2 R29.1
N$47
  Bottom 0.305: R50.2 R52.1 113.11,34.57 Q6.B
N$48
  Bottom 0.406: R33.2 113.39,50.2 IC4.6
N$49
  Bottom 0.406: R8.2 64.85,54.2 R9.1
N$50  (via drill 0.4)
  Top 0.254: TR2.3 100.74,67.67 v100.73,67.66
  Bottom 0.254: v100.73,67.66 R23.1 101.9,67.66 D12.A
N$53
  Bottom 0.305: R69.2 44.66,47.65 44.66,45.24 44.21,44.79 IC7.7 41.17,44.79 R64.1
N$54  (via drill 0.4)  (1 unrouted)
  Top 0.406: v117.62,41.31 117.62,32.99 v120.09,30.51
  Bottom 0.305: IC5.7 119.69,27.82 119.33,27.46 116.09,27.46 115.78,27.78 115.78,28.86
  Bottom 0.356: IC5.7 119.69,30.1 v120.09,30.51
  Bottom 0.406: C43.1 121.66,31.25 C44.1 v120.09,30.51 | v117.62,41.31 R43.1
N$55  (via drill 0.4)
  Top 0.406: v105.81,46.83 105.81,45.56 v103.29,43.05
  Bottom 0.406: 105.87,51.06 C38.1 105.83,50.07 | 105.83,50.07 C39.1 C40.1 105.83,46.79 v105.81,46.83 | IC4.11 105.89,50.13 105.83,50.07 | v103.29,43.05 102.92,43.05 D16.C
N$56
  Top 2.54: TR2.8 95.01,73.5
  Top 3.81: 95.01,73.5 93.36,73.5 92.86,73 Q2.D
N$57  (via drill 0.4)
  Top 0.305: JP4.COM 14.18,45.94 14.37,45.75 18.37,45.75 19.26,44.86 v21.23,44.86 | v21.23,39.59 40.4,39.59 v44.72,35.27
  Bottom 0.305: v21.23,44.86 v21.23,39.59 | IC8.5 44.02,32.67 44.28,32.92 44.28,34.83 v44.72,35.27
N$58
  Top 0.305: P1.S 6.62,47.59 7.51,46.7 12.84,46.7 JP4.NO
N$63
  Bottom 0.406: D16.A R36.1
N$64
  Bottom 0.305: R67.2 R68.1
N$65  (via drill 0.4)
  Top 0.406: v116.54,32.23 116.54,45.24 v117.62,46.32
  Bottom 0.305: IC5.4 117.74,31.57 C48.2 117.3,32.29 116.54,32.29 R50.1
  Bottom 0.406: R35.1 117.62,46.71 v117.62,46.32 | v116.54,32.23 116.54,32.29
N$66
  Bottom 0.813: C61.1 R56.2 R57.2
N$67
  Bottom 0.813: R62.2 38.56,16.16 | 38.56,16.16 R63.2 | C65.1 38.5,16.09 38.56,16.16
N$74
  Bottom 0.406: D22.C 32.39,10.18 R58.2 IC6.1
N$75
  Bottom 0.406: IC6.8 30.62,16.93 R61.2 31.19,17.63 D23.C
N$76  (via drill 0.4)
  Top 0.305: v53.1,37.24 v56.66,37.24 | v45.42,36.48 44.34,36.48 40.66,40.16 35.83,40.16 v35.26,40.74
  Bottom 0.305: OK2.2 58.12,39.47 56.66,38.01 v56.66,37.24 56.66,36.22 R78.2 | IC9.1 30.18,40.99 C74.1 30.37,41.63 30.81,42.07 33.73,42.07 34.31,41.5 C73.1 v35.26,40.73 v35.26,40.74 | v45.42,36.48 IC8.1 50.44,36.48 C70.1 53.04,35.84 C69.1 v53.1,37.24
N$101
  Bottom 0.305: R12.2 17.61,57.06 R13.1 17.99,55.47 20.97,55.47 21.23,55.21 IC2.7
N$132
  Bottom 0.305: IC7.6 40.78,43.52 R64.2 R66.1
N$133
  Bottom 0.305: Q1.1 72.5,82.16 R5.2 C8.1 72.29,79.99 ZD2.C
N$134
  Bottom 0.305: R77.2 51.65,46.26 C68.1 48.76,46.19 IC7.1
N$135
  Bottom 0.305: R18.2 44.12,58.58 OK1.1
N$136  (via drill 0.4)  (1 unrouted)
  Bottom 0.305: v10.62,52.99 R14.1
N$137
  Top 0.61: 59.11,63.79 R7.2
  Top 0.813: R7.2 56.05,63.56 C12.2 56.4,63.92
  Top 1.016: D4.C 56.02,65.94 C12.2
N$138  (via drill 0.4)
  Top 0.305: v48.98,57.75 v48.98,61.06
  Bottom 0.305: IC3.7 59.83,64.61 56.98,61.76 C28.1 | v48.98,57.75 48.98,58.45 OK1.4 | C26.2 C28.1 | v48.98,61.06 56.85,61.06 C28.1
N$139
  Top 0.61: R6.2 C9.1
N$140
  Top 0.61: R2.2 C3.1
N$141  (via drill 0.4)  (1 unrouted)
  Top 0.305: v63.33,64.8 63.33,65.56 65.29,67.53 R15.1
  Bottom 0.305: R17.1 R19.2 v63.33,64.8 C27.1 | IC3.6 63.2,65.88 C27.1
N$144
  Top 0.61: R10.2 C18.1
N$146
  Top 0.61: R11.2 C21.1
N$152
  Bottom 0.305: R21.1 C26.1
N$155  (via drill 0.4)
  Top 0.305: D11.C D10.C 67.39,67.25 66.25,66.11 v66.25,62.33
  Bottom 0.305: R17.2 65.74,61.82 v66.25,62.33
NFB_OFFSET
  Bottom 0.305: C71.+ 55.45,43.14 R76.1 R77.1 R67.1
OK_A
  Bottom 0.254: 57.11,33.94 R70.1
  Bottom 0.305: R70.1 59.01,37.85 OK2.1 | R78.1 57.11,33.94
PE  (via drill 0.4, 3.2 pad 5.5)
  Top 0.813: v59.96,32.23 59.96,46.2 v54.44,51.72
  Top 1.016: 148.35,3.71 148.35,15.78 142.83,21.3 142.83,50.07 | 142.83,50.07 142.83,52.36 C5.1 | C6.1 142.83,50.07 | X2.1 148.35,3.71 | 148.35,3.71 150.21,3.71 v151,4.5
  Bottom 0.813: X2.1 138.01,1.68 62.18,1.68 59.96,3.91 v59.96,32.23 | v54.44,51.72 JP2.NO
POUT+  (via drill 0.4)
  Top 0.406: R54.1 7.74,10.87 L7.1 v8.65,13.81
  Bottom 0.305: R65.2 48.22,27.21 44.4,31.02 38.24,31.02 38.18,31.08
  Bottom 3.048: SH3.P$1 38.56,29.18 | SH2.P$2 | SH2.P$2 39.01,28.73 39,28.73 C52.+
  other vias: 8.65,14.57 8.65,13.05 8.65,15.34 8.65,12.29 9.41,12.29 9.41,13.05 9.41,13.81 9.41,14.57 9.41,15.34
  pour Bottom (isolate 0.406, rank 3): 37.61,33.05 38.56,32.1 38.56,24.99 37.48,23.91 28.85,23.91 26.94,22 25.23,20.35 25.23,8.16 24.97,7.91 18.43,7.91 17.92,8.41 17.92,10.95 16.78,12.1 8.46,12.1 8.46,15.78 25.73,33.05
PREG_OUT+
  Top 0.406: R54.2 4.27,12.25 | JP1.NC 18.69,47.09 15.32,50.45 8.4,50.45 6.81,52.04 6.81,56.23 5.29,57.75 X3.2
  Bottom 0.406: X3.2 3.38,57.75 1.41,55.78 1.41,43.66 TP7.TIP
  Bottom 0.61: C59.1 TP7.TIP 2.62,41.5 3.83,40.29 C58.1 4.77,40.1 X4.1
  Bottom 0.813: R55.2 5.46,32.85 ZD6.C
  Bottom 1.016: ZD6.C 5.46,37.19 X4.1
  pour Top (isolate 0.305, no thermals): -0.17,10.95 5.67,10.95 6.18,11.46 6.18,21.37 4.91,21.37 4.91,21.88 6.18,21.88 6.18,30 4.91,30 4.91,30.51 6.18,30.51 6.18,38.39 5.67,38.89 -0.17,38.89
PULL  (via drill 0.4)
  Top 0.356: 95.39,20.23 95.46,20.16 D21.A 96.78,21.56 119.52,21.56 120.73,22.77 v120.73,23.15
  Top 0.61: R47.2 95.21,20.48 D21.A
  Bottom 0.356: v120.73,23.15 120.35,23.15 IC5.9
PUSH  (via drill 0.4)
  Top 0.356: v99.71,19.02 101.62,20.92 119.78,20.92 121.81,22.96 v121.81,23.15
  Bottom 0.356: R46.2 96.98,7.27 98.25,8.54 98.76,9.05 99.71,10 v99.71,19.02 | v121.81,23.15 121.81,23.53 120.35,24.99 120.35,28.84 IC5.8
  Bottom 0.406: R46.2 96.21,7.03
  Bottom 0.61: D20.A 96.21,7.03
PWRGOOD  (via drill 0.4, 0.5)
  Top 0.305: X3.4 5.73,62.83 8.65,59.91 v8.65,52.99 9.48,52.17 16.14,52.17 17.73,50.58 v23.77,50.58
  Bottom 0.305: IC2.5 v23.77,50.58 | v8.65,52.99 R16.2
REF
  Bottom 0.406: 115.37,53.94 IC4.3 112.16,53.94 111.78,53.56 111.78,48.04 112.22,47.59 IC4.8 115.14,47.59 R35.2 115.72,48.16 115.72,44.67 ZD4.C | 115.37,53.94 C37.2 | 115.37,53.94 115.37,54.05
S1_DOT_OUT  (via drill 0.4, 0.5)
  Top 0.254: Q7.3 28.27,6.38 v26.37,8.29
  Top 0.406: Q7.3 36.3,8.38 v37.55,9.62
  Bottom 0.254: IC6.4 26.81,8.73 v26.37,8.29
  Bottom 0.406: v37.55,9.62 39.08,9.62 R56.1
  Bottom 0.813: R57.1 R56.1
  other vias: 37.55,8.73
  pour Top (isolate 0.406, no thermals): 32.08,10.45 50.12,10.45 50.12,16.03 45.8,16.03 45.8,19.34 60.28,19.34 60.28,-0.73 32.08,-0.73
S1_OUT
  Bottom 3.048: TR3.S1 46.06,14.25 43.96,16.35 43.96,23.78 SH2.P$1
S2_DOT_OUT
  Bottom 0.61: 43.45,29.18 SH3.P$2
  Bottom 3.048: TR3.S2_DOT 47.5,25.13 43.45,29.18
S2_OUT  (via drill 0.4, 0.5)
  Top 0.254: v27.96,19.08 36.24,19.08 Q8.3
  Top 0.406: v33.35,22.26 36.47,19.21 36.27,19.02
  Bottom 0.254: IC6.5 26.81,17.94 v27.96,19.08
  Bottom 0.406: R62.1 33.98,21.75 v33.35,22.26
  Bottom 0.813: R63.1 R62.1
  other vias: 33.35,21.37
  pour Top (isolate 0.406, rank 3, no thermals): 32.08,10.95 60.28,10.95 60.28,31.02 32.08,31.02
SR_OUT1  (via drill 0.5)
  Top 0.406: Q7.1 29.99,8.92 v31.07,7.84
  Bottom 0.406: D22.A 33.36,8.1 R58.1 31.95,7.84 v31.07,7.84
SR_OUT2  (via drill 0.5)
  Top 0.406: v31.26,21.3 Q8.1
  Bottom 0.406: R61.1 31.26,20.61 | 31.26,20.61 v31.26,21.3 | D23.A 31.18,20.53 31.26,20.61
U_MON  (via drill 0.4)
  Top 0.406: JP4.NC 15.32,48.61 14.49,49.44 v11.95,49.44
  Bottom 0.406: v11.95,49.44 10.24,51.15 7.13,51.15 4.59,53.69 X3.1
U_MON1
  Bottom 0.305: IC8.6 IC8.7 43.45,35.21 44.59,36.35 44.59,37.88 45.29,38.57 46.94,38.57 R73.2
ULVO  (via drill 0.4)
  Top 0.254: TP5.1 125.87,16.54 | 125.87,16.54 v125.87,17.62 | v111.27,17.62 113.17,17.62 114.25,16.54 125.87,16.54
  Bottom 0.254: v111.27,17.62 R44.2 109.37,20.35 R45.1 109.3,20.16 107.46,20.16 C42.1 | v125.87,17.62 125.87,21.05 129.62,24.8 129.62,63.85 127.91,65.56 R42.2
V+  (via drill 0.4)
  Top 0.305: 42.5,45.75 56.21,45.75 58.63,43.34 v58.63,33.05
  Top 0.406: X3.5 2.94,65.37 2.37,64.8 2.37,47.28 4.53,45.12 18.11,45.12 19.26,43.97 42.5,43.97 | 42.5,43.97 42.5,41.62 v43.39,40.74 | 42.5,43.97 42.5,45.75 v42.5,48.42
  Bottom 0.305: R12.1 16.21,59.02 D7.A | R70.2 59.01,33.43 v58.63,33.05 54.24,28.67 51.64,28.67 51.14,29.18 R72.2 | R16.1 8.65,57.24 9.03,57.63 12.46,57.63 12.46,57.93 12.47,57.94
  Bottom 0.406: v42.5,48.42 C64.1 42.75,47.3 42.75,46.07 42.76,46.06 IC7.8 | IC8.8 42.97,38.14 C67.1 43.03,40.38 v43.39,40.74
  Bottom 0.508: C23.+ IC2.1
  Bottom 0.61: C23.+ 19.89,61.63 17.29,61.63 15.13,59.47 D7.A D9.C 12.47,57.94 8.34,62.07 8.34,63.98 6.94,65.37 X3.5
V-  (via drill 0.4)
  Top 0.406: X3.7 3.38,70.45 1.54,68.61 1.54,47.15 4.27,44.42 17.86,44.42 19,43.28 39.32,43.28 42.82,39.78 49.04,39.78 v49.74,40.48
  Bottom 0.406: 48.66,42.22 IC7.4 48.63,40.54 C66.1 v49.74,40.48
  Bottom 0.61: D6.C D3.A | D3.A 7.51,70.45 X3.7 | D3.A 8.27,72.83 C17.2 8.81,73.37 IC1.1
VIPER_D
  Top 1.016: D4.A 51.85,71.03 TR1.4
  pour Bottom (isolate 0.305, no thermals): 57.29,72.55 57.29,68.17 54.5,68.17 54.5,70.83 51.07,70.83 51.07,72.17 54.5,72.17 54.5,72.55

## Text on the board
tPlace: HI-SIDE | CAUTION! | HIGH VOLTAGE | EEZ CF-DIC (08/2018 r3B1) | LO-SIDE | PULL | SREC2 | AC in | PUSH | SREC1
bPlace: EEZ CF-DIC (08/2018 r3B1) | Project source code: github.com/eez-open | X3 connector | 8 -9Vdc | 7 -5Vdc | 6 Gnd | HI-SIDE | 5 +5Vdc | 4 Pwrgood | 3 Bias+ | 2 Bias- | 1 U_MON | LO-SIDE | PULL | PUSH | CAUTION! | HIGH VOLTAGE
Measures: Licensed under the TAPR Open Hardware License (www.tapr.org/OHL)
_tNames: D1 | R2 | C32 | C31 | R10 | TP3 | C18 | TR2 | C7 | C14 | B1 | X3 | L3 | D5 | C21 | C3 | D8 | D4 | X1 | C15 | R4 | R15 | D10 | D11 | R11 | TP1 | Q2 | C24 | TP4 | C25 | D2 | C9 | C10 | TR1 | C12 | R7 | L4 | C19 | D15 | LED1 | C13 | C6 | C5 | P1 | TP2 | Q3 | R6 | JP4 | JP1 | C11 | L2 | TP7 | C2 | C52 | R34 | C54 | TP6 | TP8 | X4 | D17 | Q5 | C57 | L1 | L6 | C56 | R47 | D21 | C1 | Q8 | TP5 | L7 | R54 | Q4 | X2 | Q7 | C53 | TR3 | L5
_bNames: R5 | C8 | ZD2 | C4 | C36 | IC1 | Q1 | R38 | C17 | C16 | D12 | R24 | R25 | R42 | R23 | ZD1 | C20 | D3 | D6 | IC3 | C27 | D13 | C23 | D14 | R19 | R22 | C28 | R27 | R26 | C29 | C30 | R17 | R12 | ZD3 | OK1 | C26 | R18 | C33 | R16 | R14 | R21 | R20 | R30 | IC2 | C34 | C35 | C37 | R28 | JP2 | D9 | D7 | R8 | R32 | R13 | R9 | C22 | R40 | C38 | R41 | R33 | C64 | R69 | C39 | R77 | R67 | R35 | IC7 | C68 | C40 | R64 | C59 | IC4 | ZD4 | R66 | R39 | C74 | R76 | R68 | R43 | C73 | C58 | C66 | OK2 | C71 | IC9 | C67 | R37 | D16 | R75 | R36 | R79 | R73 | C70 | C69 | D18 | C46 | ZD6 | R80 | Q6 | R52 | R50 | C48 | C43 | C44 | R74 | R78 | R70 | IC8 | C72 | C50 | R72 | C60 | C51 | R55 | R53 | C41 | R1 | R3 | IC5 | R62 | R63 | R65 | R71 | JP3 | D23 | ZD5 | R31 | IC6 | R61 | C42 | R45 | R44 | R49 | R48 | C45 | C49 | R51 | C47 | C65 | R58 | R56 | R57 | R60 | C55 | R59 | R29 | C63 | D22 | R46 | D19 | C61 | D20 | C62